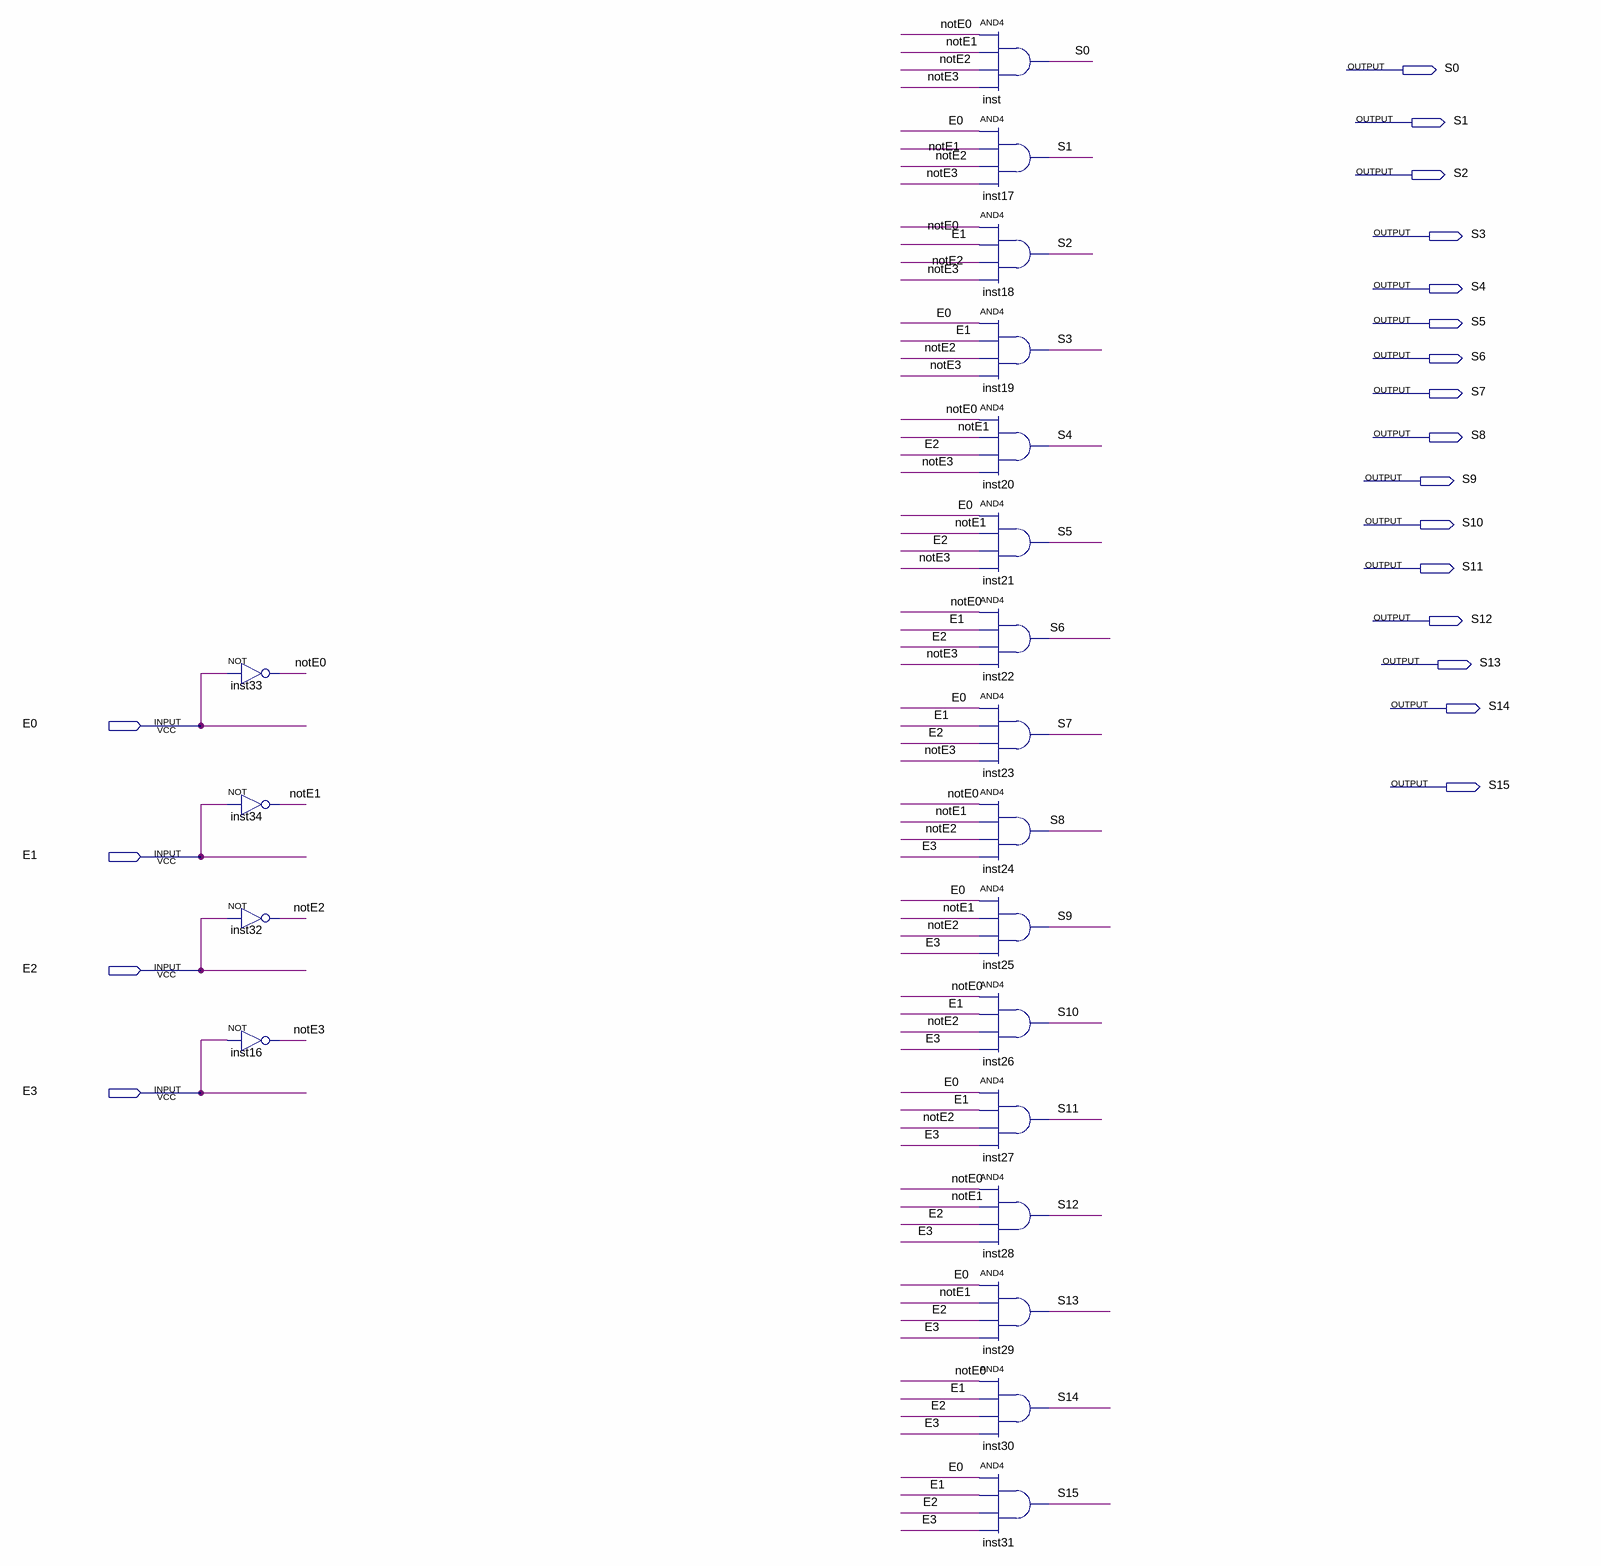
[diagram p0: schematic sheet]
// Quartus schematic DECODER.bdf as structural Verilog: 20 symbols, 20 pins
module DECODER (
  input  E0,
  input  E1,
  input  E2,
  input  E3,
  output S0,
  output S1,
  output S2,
  output S3,
  output S4,
  output S5,
  output S6,
  output S7,
  output S8,
  output S9,
  output S10,
  output S11,
  output S12,
  output S13,
  output S14,
  output S15
);

  wire notE0, notE1, notE2, notE3;

  not inst33 (notE0, E0);
  not inst34 (notE1, E1);
  not inst32 (notE2, E2);
  not inst16 (notE3, E3);
  and inst (S0, notE0, notE1, notE2, notE3);
  and inst17 (S1, E0, notE1, notE2, notE3);
  and inst18 (S2, notE0, E1, notE2, notE3);
  and inst19 (S3, E0, E1, notE2, notE3);
  and inst20 (S4, notE0, notE1, E2, notE3);
  and inst21 (S5, E0, notE1, E2, notE3);
  and inst22 (S6, notE0, E1, E2, notE3);
  and inst23 (S7, E0, E1, E2, notE3);
  and inst24 (S8, notE0, notE1, notE2, E3);
  and inst25 (S9, E0, notE1, notE2, E3);
  and inst26 (S10, notE0, E1, notE2, E3);
  and inst27 (S11, E0, E1, notE2, E3);
  and inst28 (S12, notE0, notE1, E2, E3);
  and inst29 (S13, E0, notE1, E2, E3);
  and inst30 (S14, notE0, E1, E2, E3);
  and inst31 (S15, E0, E1, E2, E3);
endmodule
